# Altium schematic sheet Sheet6.SchDoc
size A4
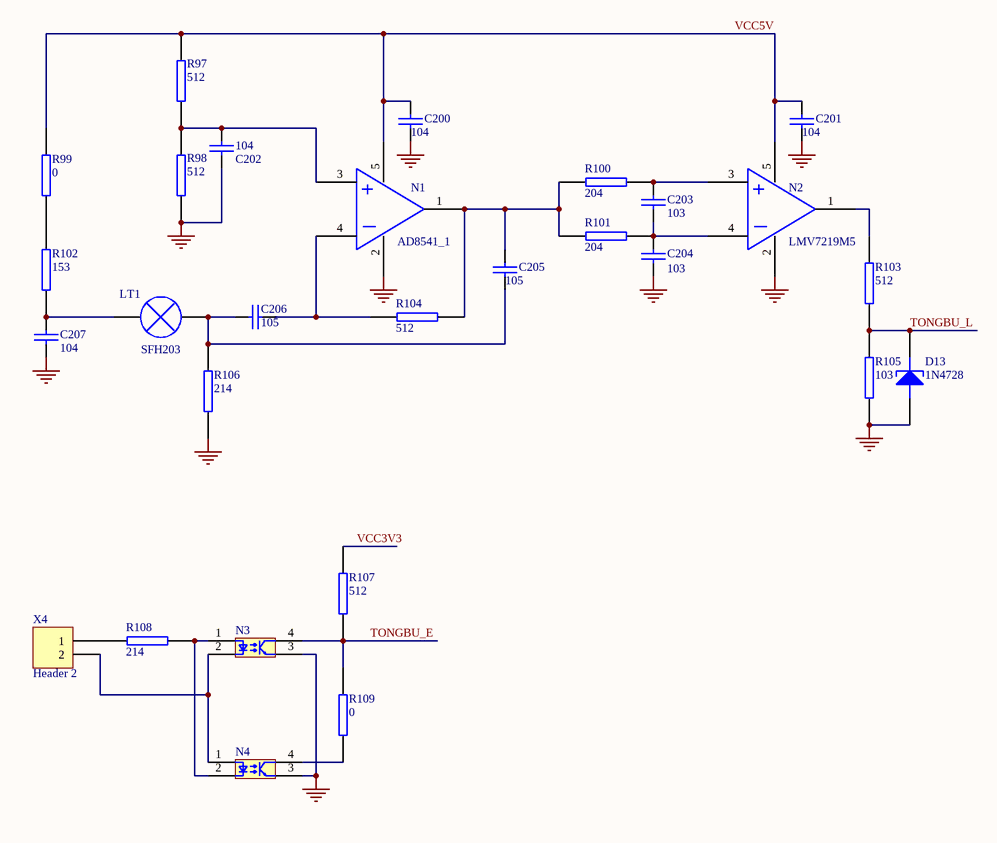
[diagram p0: Sheet6.SchDoc]

## Parts
C200  104  [0603]
C201  104  [0603]
C202  104  [0603]
C203  103  [0603]
C204  103  [0603]
C205  105  [0603]
C206  105  [0603]
C207  104  [0603]
D13  1N4728  [M7]
LT1  SFH203  [LED5]
N1  AD8541_1  [SOT-23-5]
N2  LMV7219M5  [SOT-23-5]
N3  TLP281-1(SOC4)  [TLP821-1]  (value not drawn)
N4  TLP281-1(SOC4)  [TLP821-1]  (value not drawn)
R97  512  [0603]
R98  512  [0603]
R99  0  [0603]
R100  204  [0603]
R101  204  [0603]
R102  153  [0603]
R103  512  [0603]
R104  512  [0603]
R105  103  [0603]
R106  214  [0603]
R107  512  [0603]
R108  214  [AXIAL-0.4]
R109  0  [0603]
X4  Header 2  [SIP2X]

## Nets
GND: C200.2 C201.2 C202.2 C204.2 C207.2 D13.1(A) N1.2 N2.2 N3.3 N4.3 R98.1 R105.1 R106.2
TONGBU_E: N3.4 R107.1 R109.2
TONGBU_L: D13.2(K) R103.1 R105.2
VCC3V3: R107.2
VCC5V: C200.1 C201.1 N1.5 N2.5 R97.2 R99.2
NetC202_1: C202.1 N1.3 R97.1 R98.2
NetC203_1: C203.1 N2.3 R100.2
NetC203_2: C203.2 C204.1 N2.4 R101.2
NetC205_1: C205.1 N1.1 R100.1 R101.1 R104.1
NetC205_2: C205.2 C206.1 LT1.2 R106.1
NetC206_2: C206.2 N1.4 R104.2
NetC207_1: C207.1 LT1.1 R102.1
NetN2_1: N2.1 R103.2
NetN3_1: N3.1 N4.2 R108.2
NetN3_2: N3.2 N4.1 X4.2
NetN4_4: N4.4 R109.1
NetR99_1: R99.1 R102.2
NetR108_1: R108.1 X4.1

## Library data of the parts
C200-C207 = CAP: Capacitor
D13 = DIODE TUNNEL
LT1 = LAMP
N1 N2 = OPA
N3 N4 = TLP521-1
R97-R109 = RES2
X4 = Header 2: Header, 2-Pin; LatestRevisionDate: 17-Jul-2002; LatestRevisionNote: Re-released for DXP Platform.; Publisher: Altium Limited